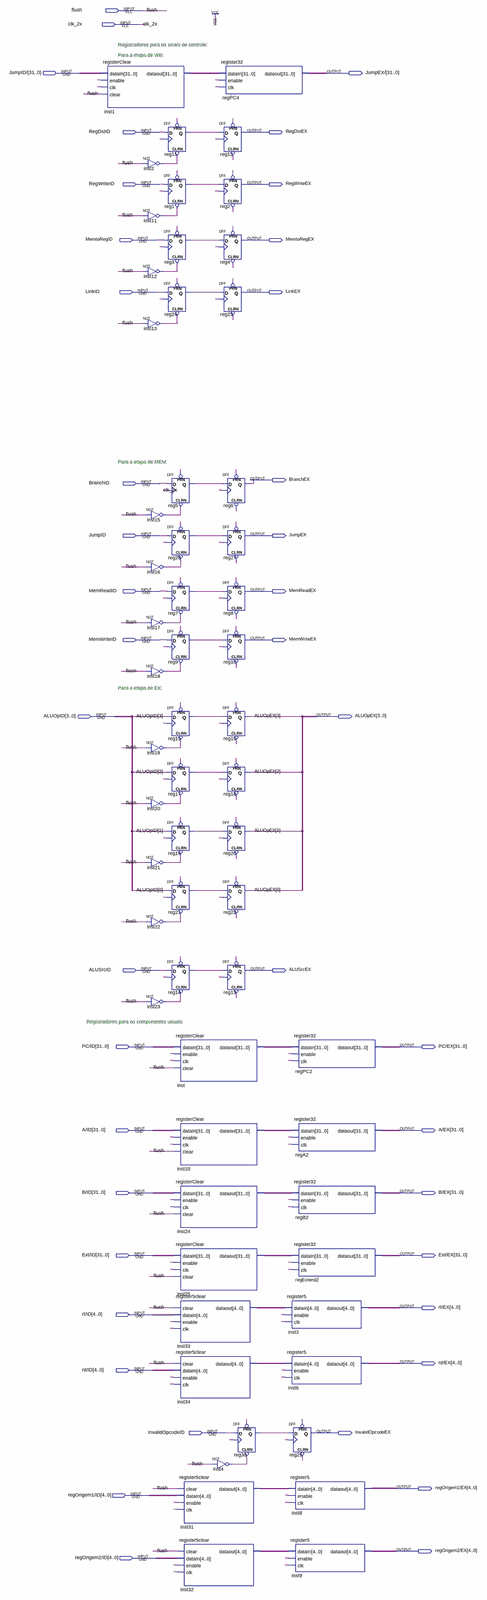
[diagram p0: schematic sheet, whole]
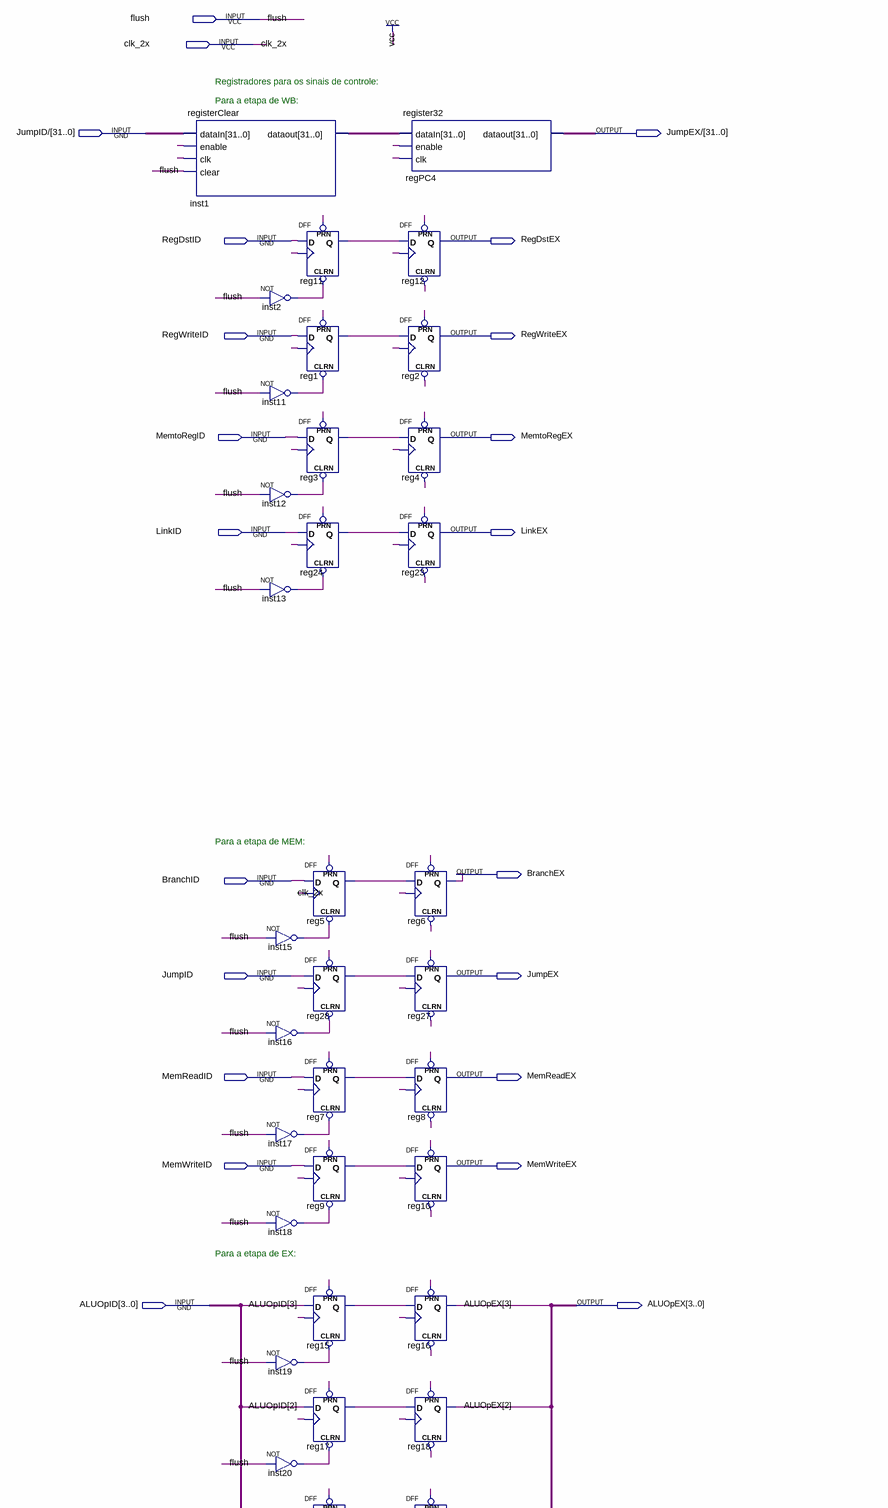
[diagram p1: schematic sheet, upper part]
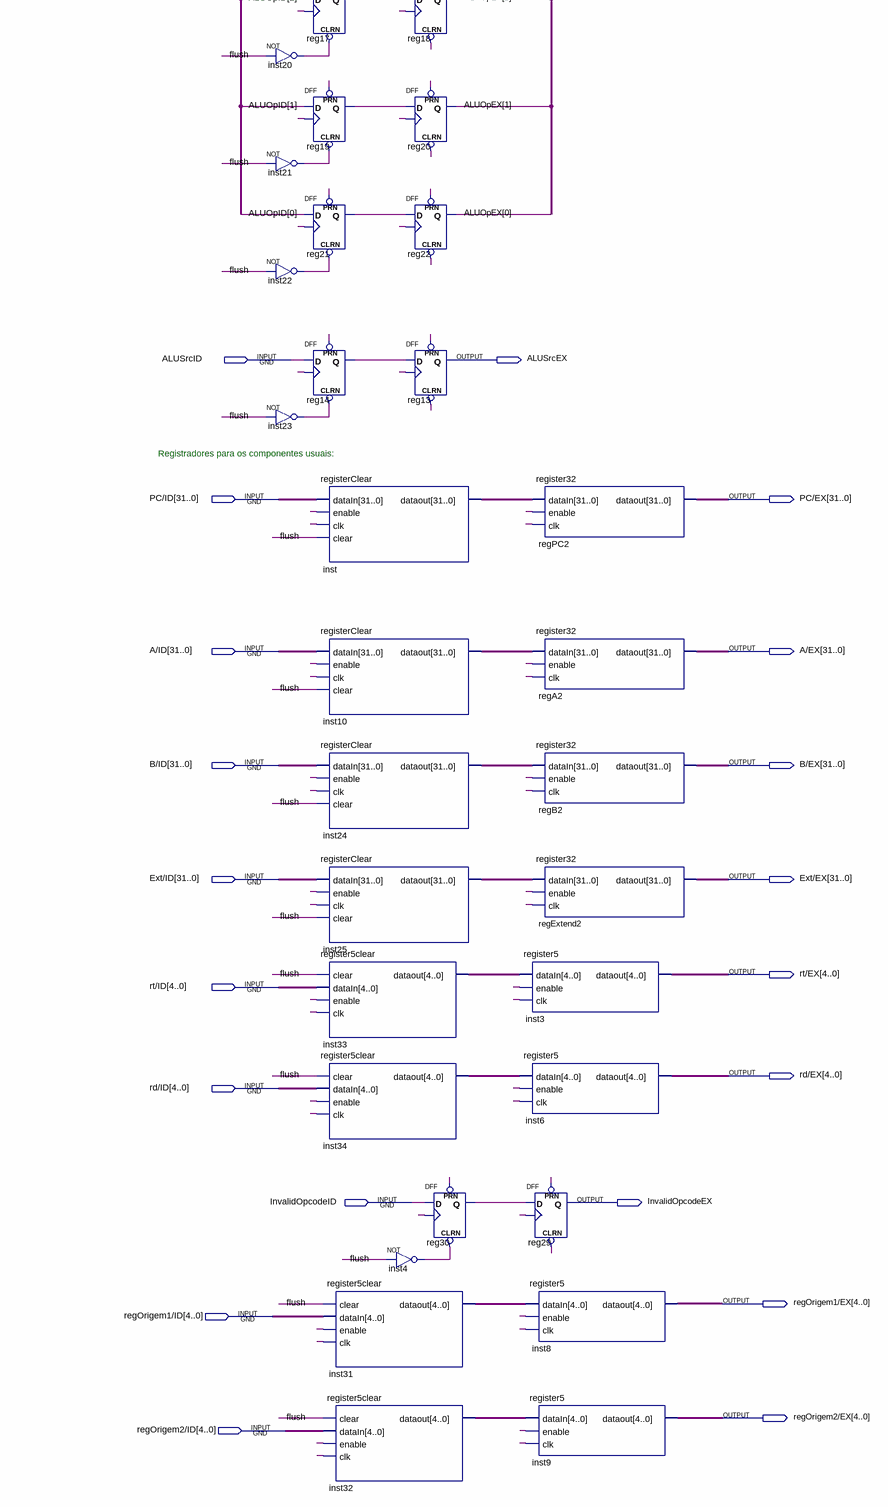
[diagram p2: schematic sheet, lower part]
// Quartus schematic registerIDEX.bdf as structural Verilog: 60 symbols, 42 pins
module registerIDEX (
  input  flush,
  input  clk_2x,
  input  [31:0] \JumpID/ ,
  input  RegDstID,
  input  RegWriteID,
  input  MemtoRegID,
  input  LinkID,
  input  BranchID,
  input  JumpID,
  input  MemReadID,
  input  MemWriteID,
  input  [3:0] ALUOpID,
  input  ALUSrcID,
  input  [31:0] \PC/ID ,
  input  [31:0] \A/ID ,
  input  [31:0] \B/ID ,
  input  [31:0] \Ext/ID ,
  input  [4:0] \rt/ID ,
  input  [4:0] \rd/ID ,
  input  InvalidOpcodeID,
  input  [4:0] \regOrigem1/ID ,
  input  [4:0] \regOrigem2/ID ,
  output [31:0] \JumpEX/ ,
  output RegDstEX,
  output RegWriteEX,
  output MemtoRegEX,
  output LinkEX,
  output BranchEX,
  output JumpEX,
  output MemReadEX,
  output MemWriteEX,
  output [3:0] ALUOpEX,
  output ALUSrcEX,
  output [31:0] \PC/EX ,
  output [31:0] \A/EX ,
  output [31:0] \B/EX ,
  output [31:0] \Ext/EX ,
  output [4:0] \rt/EX ,
  output [4:0] \rd/EX ,
  output InvalidOpcodeEX,
  output [4:0] \regOrigem1/EX ,
  output [4:0] \regOrigem2/EX 
);

  wire inst2_out, inst4_out, inst11_out, inst12_out, inst13_out, inst15_out, inst16_out, inst17_out,
       inst18_out, inst19_out, inst20_out, inst21_out, inst22_out, inst23_out, reg1_q, reg3_q, reg5_q,
       reg7_q, reg9_q, reg11_q, reg14_q, reg15_q, reg17_q, reg19_q, reg21_q, reg24_q, reg28_q, reg30_q;
  wire [4:0] inst31_dataout, inst32_dataout, inst33_dataout, inst34_dataout;
  wire [31:0] inst1_dataout, inst10_dataout, inst24_dataout, inst25_dataout, inst_dataout;

  registerClear inst1 (.dataIn(\JumpID/ ), .enable(1'b1), .clk(clk_2x), .clear(flush), .dataout(inst1_dataout));
  not inst2 (inst2_out, flush);
  not inst11 (inst11_out, flush);
  not inst12 (inst12_out, flush);
  not inst13 (inst13_out, flush);
  not inst15 (inst15_out, flush);
  not inst16 (inst16_out, flush);
  not inst17 (inst17_out, flush);
  not inst18 (inst18_out, flush);
  not inst19 (inst19_out, flush);
  not inst20 (inst20_out, flush);
  not inst21 (inst21_out, flush);
  not inst22 (inst22_out, flush);
  not inst23 (inst23_out, flush);
  DFF reg11 (.CLRN(inst2_out), .CLK(clk_2x), .D(RegDstID), .PRN(1'b1), .Q(reg11_q));
  DFF reg1 (.CLRN(inst11_out), .CLK(clk_2x), .D(RegWriteID), .PRN(1'b1), .Q(reg1_q));
  DFF reg3 (.CLRN(inst12_out), .CLK(clk_2x), .D(MemtoRegID), .PRN(1'b1), .Q(reg3_q));
  DFF reg24 (.CLRN(inst13_out), .CLK(clk_2x), .D(LinkID), .PRN(1'b1), .Q(reg24_q));
  DFF reg5 (.CLRN(inst15_out), .CLK(clk_2x), .D(BranchID), .PRN(1'b1), .Q(reg5_q));
  DFF reg28 (.CLRN(inst16_out), .CLK(clk_2x), .D(JumpID), .PRN(1'b1), .Q(reg28_q));
  DFF reg7 (.CLRN(inst17_out), .CLK(clk_2x), .D(MemReadID), .PRN(1'b1), .Q(reg7_q));
  DFF reg9 (.CLRN(inst18_out), .CLK(clk_2x), .D(MemWriteID), .PRN(1'b1), .Q(reg9_q));
  DFF reg15 (.CLRN(inst19_out), .CLK(clk_2x), .D(ALUOpID[3]), .PRN(1'b1), .Q(reg15_q));
  DFF reg17 (.CLRN(inst20_out), .CLK(clk_2x), .D(ALUOpID[2]), .PRN(1'b1), .Q(reg17_q));
  DFF reg19 (.CLRN(inst21_out), .CLK(clk_2x), .D(ALUOpID[1]), .PRN(1'b1), .Q(reg19_q));
  DFF reg21 (.CLRN(inst22_out), .CLK(clk_2x), .D(ALUOpID[0]), .PRN(1'b1), .Q(reg21_q));
  DFF reg14 (.CLRN(inst23_out), .CLK(clk_2x), .D(ALUSrcID), .PRN(1'b1), .Q(reg14_q));
  registerClear inst (.dataIn(\PC/ID ), .enable(1'b1), .clk(clk_2x), .clear(flush), .dataout(inst_dataout));
  registerClear inst10 (.dataIn(\A/ID ), .enable(1'b1), .clk(clk_2x), .clear(flush), .dataout(inst10_dataout));
  registerClear inst24 (.dataIn(\B/ID ), .enable(1'b1), .clk(clk_2x), .clear(flush), .dataout(inst24_dataout));
  registerClear inst25 (.dataIn(\Ext/ID ), .enable(1'b1), .clk(clk_2x), .clear(flush), .dataout(inst25_dataout));
  register5clear inst33 (.clear(flush), .dataIn(\rt/ID ), .enable(1'b1), .clk(clk_2x), .dataout(inst33_dataout));
  register5clear inst34 (.clear(flush), .dataIn(\rd/ID ), .enable(1'b1), .clk(clk_2x), .dataout(inst34_dataout));
  register5clear inst31 (
    .clear(flush), .dataIn(\regOrigem1/ID ), .enable(1'b1), .clk(clk_2x), .dataout(inst31_dataout));
  register5clear inst32 (
    .clear(flush), .dataIn(\regOrigem2/ID ), .enable(1'b1), .clk(clk_2x), .dataout(inst32_dataout));
  register32 regPC4 (.dataIn(inst1_dataout), .enable(1'b1), .clk(clk_2x), .dataout(\JumpEX/ ));
  DFF reg12 (.CLRN(1'b1), .CLK(clk_2x), .D(reg11_q), .PRN(1'b1), .Q(RegDstEX));
  DFF reg2 (.CLRN(1'b1), .CLK(clk_2x), .D(reg1_q), .PRN(1'b1), .Q(RegWriteEX));
  DFF reg4 (.CLRN(1'b1), .CLK(clk_2x), .D(reg3_q), .PRN(1'b1), .Q(MemtoRegEX));
  DFF reg23 (.CLRN(1'b1), .CLK(clk_2x), .D(reg24_q), .PRN(1'b1), .Q(LinkEX));
  DFF reg6 (.CLRN(1'b1), .CLK(clk_2x), .D(reg5_q), .PRN(1'b1), .Q(BranchEX));
  DFF reg27 (.CLRN(1'b1), .CLK(clk_2x), .D(reg28_q), .PRN(1'b1), .Q(JumpEX));
  DFF reg8 (.CLRN(1'b1), .CLK(clk_2x), .D(reg7_q), .PRN(1'b1), .Q(MemReadEX));
  DFF reg10 (.CLRN(1'b1), .CLK(clk_2x), .D(reg9_q), .PRN(1'b1), .Q(MemWriteEX));
  DFF reg16 (.CLRN(1'b1), .CLK(clk_2x), .D(reg15_q), .PRN(1'b1), .Q(ALUOpEX[3]));
  DFF reg18 (.CLRN(1'b1), .CLK(clk_2x), .D(reg17_q), .PRN(1'b1), .Q(ALUOpEX[2]));
  DFF reg20 (.CLRN(1'b1), .CLK(clk_2x), .D(reg19_q), .PRN(1'b1), .Q(ALUOpEX[1]));
  DFF reg22 (.CLRN(1'b1), .CLK(clk_2x), .D(reg21_q), .PRN(1'b1), .Q(ALUOpEX[0]));
  DFF reg13 (.CLRN(1'b1), .CLK(clk_2x), .D(reg14_q), .PRN(1'b1), .Q(ALUSrcEX));
  not inst4 (inst4_out, flush);
  DFF reg30 (.CLRN(inst4_out), .CLK(clk_2x), .D(InvalidOpcodeID), .PRN(1'b1), .Q(reg30_q));
  register5 inst3 (.dataIn(inst33_dataout), .enable(1'b1), .clk(clk_2x), .dataout(\rt/EX ));
  register5 inst6 (.dataIn(inst34_dataout), .enable(1'b1), .clk(clk_2x), .dataout(\rd/EX ));
  register32 regPC2 (.dataIn(inst_dataout), .enable(1'b1), .clk(clk_2x), .dataout(\PC/EX ));
  register32 regA2 (.dataIn(inst10_dataout), .enable(1'b1), .clk(clk_2x), .dataout(\A/EX ));
  register32 regB2 (.dataIn(inst24_dataout), .enable(1'b1), .clk(clk_2x), .dataout(\B/EX ));
  register32 regExtend2 (.dataIn(inst25_dataout), .enable(1'b1), .clk(clk_2x), .dataout(\Ext/EX ));
  DFF reg29 (.CLRN(1'b1), .CLK(clk_2x), .D(reg30_q), .PRN(1'b1), .Q(InvalidOpcodeEX));
  register5 inst8 (.dataIn(inst31_dataout), .enable(1'b1), .clk(clk_2x), .dataout(\regOrigem1/EX ));
  register5 inst9 (.dataIn(inst32_dataout), .enable(1'b1), .clk(clk_2x), .dataout(\regOrigem2/EX ));

  // Notes on the sheet:
  //   Registradores para os sinais de controle:
  //   Para a etapa de WB:
  //   Para a etapa de MEM:
  //   Para a etapa de EX:
  //   Registradores para os componentes usuais:
endmodule
